# Altium schematic sheet Humidifier.SchDoc
size A3
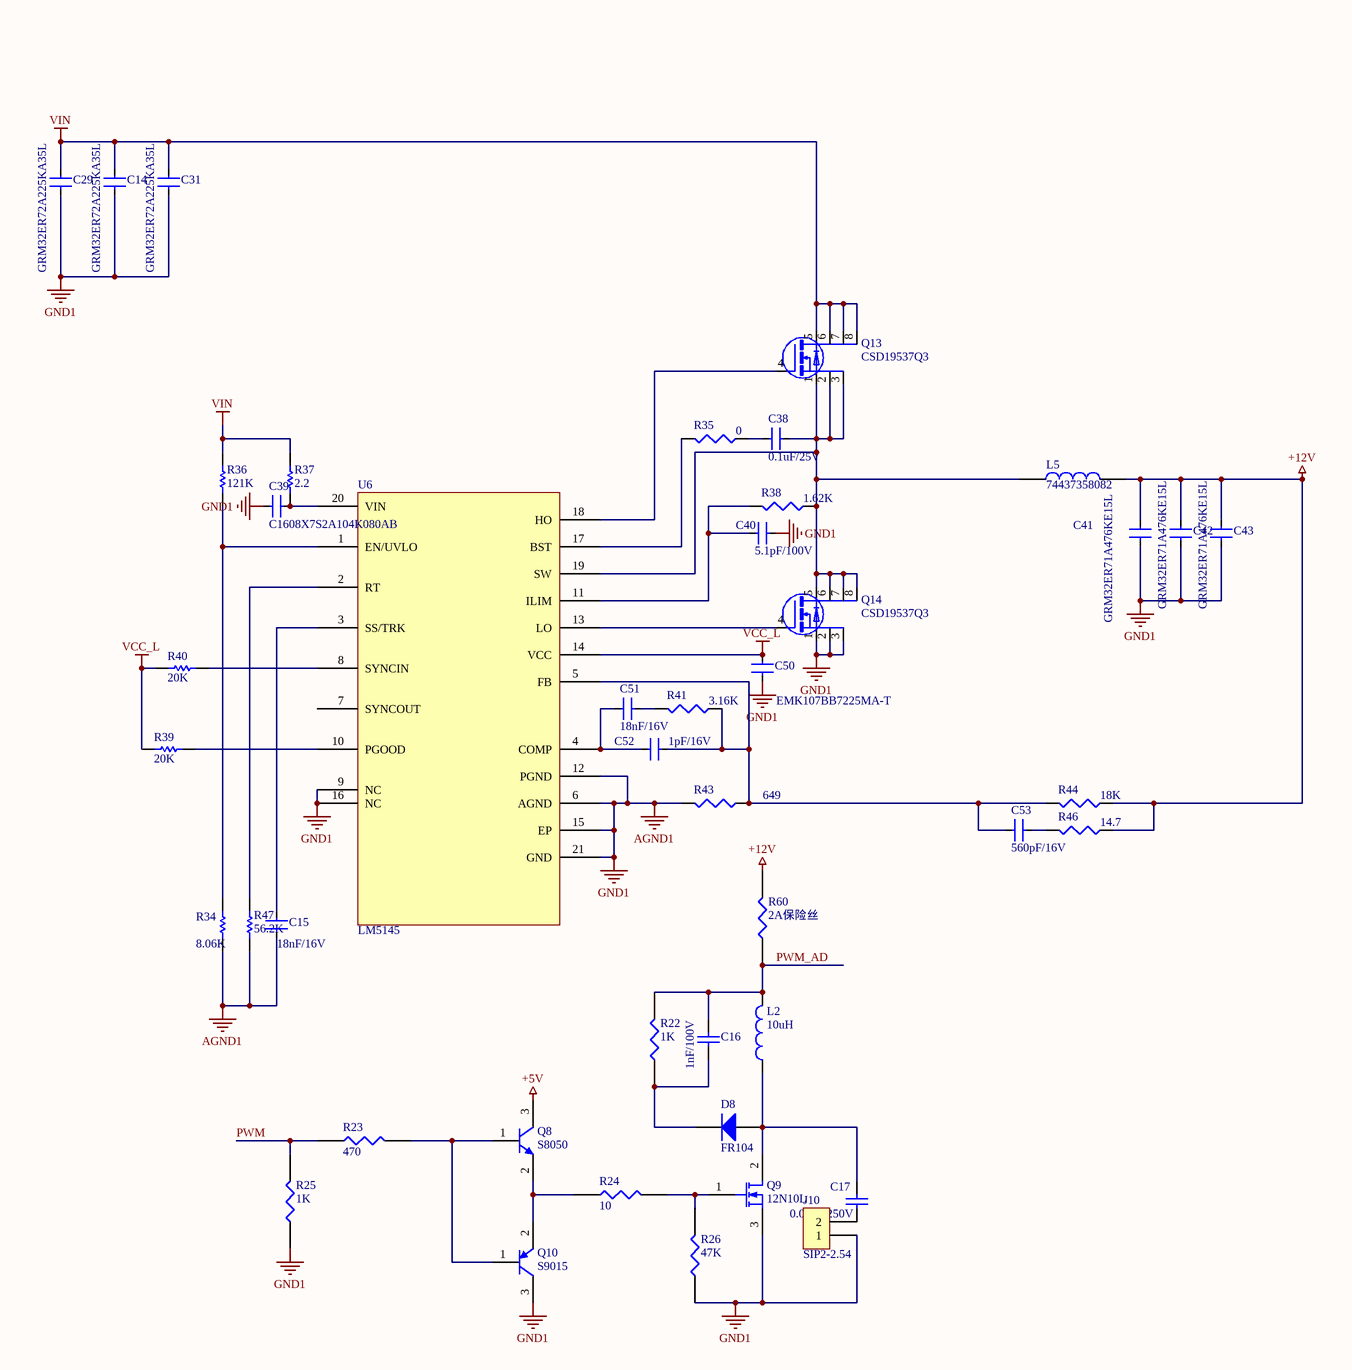
[diagram p0: Humidifier.SchDoc]

## Parts
C14  GRM32ER72A225KA35L  [1210C]
C15  18nF/16V  [0603C]
C16  1nF/100V  [CAP_5MM]
C17  0.047F/250V  [CAP_5MM]
C29  GRM32ER72A225KA35L  [1210C]
C31  GRM32ER72A225KA35L  [1210C]
C38  0.1uF/25V  [0603C]
C39  C1608X7S2A104K080AB  [0603C]
C40  5.1pF/100V  [0603C]
C41  GRM32ER71A476KE15L  [1210C]
C42  GRM32ER71A476KE15L  [1210C]
C43  GRM32ER71A476KE15L  [1210C]
C50  EMK107BB7225MA-T  [0603C]
C51  18nF/16V  [0603C]
C52  1pF/16V  [0603C]
C53  560pF/16V  [0603C]
D8  FR104  [SMA]
J10  SIP2-2.54  [SIP-2L]
L2  10uH  [6*8]
L5  74437358082  [SRP1270-2R2M]
Q8  S8050  [SOT23-3]
Q9  12N10L  [TO230P973X238-3N]
Q10  S9015  [SOT23-3]
Q13  CSD19537Q3  [PowerPAK SO-8]
Q14  CSD19537Q3  [PowerPAK SO-8]
R22  1K  [0805R]
R23  470  [0805R]
R24  10  [0805R]
R25  1K  [0805R]
R26  47K  [0805R]
R34  8.06K  [0603R]
R35  0  [0603R]
R36  121K  [0805R]
R37  2.2  [0603R]
R38  1.62K  [0603R]
R39  20K  [0603R]
R40  20K  [0603R]
R41  3.16K  [0603R]
R43  649  [0603R]
R44  18K  [0603R]
R46  14.7  [0603R]
R47  56.2K  [0603R]
R60  2A保险丝  [0805R]
U6  LM5145  [QFN050P600-8N]

## Nets
+5V: Q8.3(C)
+12V: C41.1 C42.1 C43.1 L5.2 R44.1 R46.1 R60.2
AGND1: C14.2 C15.2 C29.2 C31.2 C39.1 C40.1 C41.2 C42.2 C43.2 C50.2 J10.1 Q9.3(S) Q10.3(C) Q14.1(S) Q14.2(S) Q14.3(S) R25.1 R26.1 R34.1 R43.2 R47.1 U6.6(AGND) U6.9(NC) U6.12(PGND) U6.15(EP) U6.16(NC) U6.21(GND)  [also labelled GND1]
VCC_L: C50.1 R39.2 R40.2 U6.14(VCC)
VIN: C14.1 C29.1 C31.1 Q13.5(D) Q13.6(D) Q13.7(D) Q13.8(D) R36.2 R37.1
PWM: R23.1 R25.2
PWM_AD: C16.2 L2.2 R22.2 R60.1
NetC15_1: C15.1 U6.3(SS/TRK)
NetC16_1: C16.1 D8.2(K) R22.1
NetC17_1: C17.1 J10.2
NetC17_2: C17.2 D8.1(A) L2.1 Q9.2(D)
NetC38_1: C38.1 R35.1
NetC38_2: C38.2 L5.1 Q13.1(S) Q13.2(S) Q13.3(S) Q14.5(D) Q14.6(D) Q14.7(D) Q14.8(D) R38.1 U6.19(SW)
NetC39_2: C39.2 R37.2 U6.20(VIN)
NetC40_2: C40.2 R38.2 U6.11(ILIM)
NetC51_1: C51.1 C52.1 U6.4(COMP)
NetC51_2: C51.2 R41.2
NetC52_2: C52.2 C53.1 R41.1 R43.1 R44.2 U6.5(FB)
NetC53_2: C53.2 R46.2
NetQ8_1: Q8.1(B) Q10.1(B) R23.2
NetQ8_2: Q8.2(E) Q10.2(E) R24.1
NetQ9_1: Q9.1(G) R24.2 R26.2
NetQ13_4: Q13.4(G) U6.18(HO)
NetQ14_4: Q14.4(G) U6.13(LO)
NetR34_2: R34.2 R36.1 U6.1(EN/UVLO)
NetR35_2: R35.2 U6.17(BST)
NetR39_1: R39.1 U6.10(PGOOD)
NetR40_1: R40.1 U6.8(SYNCIN)
NetR47_2: R47.2 U6.2(RT)

Not connected (* = marked no-connect by the designer): U6 7(SYNCOUT)

## Library data of the parts
C14 C15 C29 C31 C38-C43 C50-C53 = 0.01UF: CCX85-103
C16 = Cap: Capacitor; Published: 8-Jun-2000; LatestRevisionDate: 17-Jul-2002; LatestRevisionNote: Re-released for DXP Platform.; PackageReference: RAD-0.3; Publisher: Altium Limited; Value: 1nF/100V
C17 = Cap: Capacitor; Value: 1nF/100V; Published: 8-Jun-2000; LatestRevisionDate: 17-Jul-2002; LatestRevisionNote: Re-released for DXP Platform.; PackageReference: RAD-0.3; Publisher: Altium Limited
D8 = Diode_2: Default Diode; Published: 8-Jun-2000; LatestRevisionDate: 17-Jul-2002; LatestRevisionNote: Re-released for DXP Platform.; PackageVersion: Sep-1996; PackageReference: SMC; Publisher: Altium Limited; PackageDescription: DO-214-AB/SMC; 2 C-Bend Leads; Body 7.9 x 5.9 mm, inc. leads (LxW); Code_JEDEC: DO-214-AB
J10 = SIP2-2.54: CN-SIP2-2.54
L2 = Inductor: Code_IEC: 1005; Published: 8-Jun-2000; LatestRevisionDate: 29-May-2009; LatestRevisionNote: IPC-7351 Footprint Added.; PackageReference: 0402-A; Publisher: Altium Limited; PackageDescription: Chip Inductor; Code_JEITA: 0402; Value: 10uH
L5 = INDUCTOR
Q8 = NPN: NPN Bipolar Transistor; Published: 8-Jun-2000; LatestRevisionDate: 17-Jul-2002; LatestRevisionNote: Re-released for DXP Platform.; PackageReference: TO-226; Publisher: Altium Limited; Code_JEDEC: TO-226-AA
Q9 = MOSFET-N: N-Channel MOSFET; Published: 8-Jun-2000; LatestRevisionDate: 17-Jul-2002; LatestRevisionNote: Re-released for DXP Platform.; PackageVersion: 1995/1996; PackageReference: E3; Publisher: Altium Limited
Q10 = PNP: PNP Bipolar Transistor; Published: 8-Jun-2000; LatestRevisionDate: 29-May-2009; LatestRevisionNote: IPC-7351 Footprint Added.; PackageVersion: Aug-1999; PackageReference: SOT-23B; Publisher: Altium Limited; PackageDescription: 3-Pin SOT-23 Package 0.95 mm Pitch, 2.4 mm Lead Span
Q13 Q14 = Si4004DY
R22-R26 R60 = RES1
R34 R36 R37 R39 R40 R47 = Res Semi: Semiconductor Resistor; Value: 1K; Published: 8-Jun-2000; LatestRevisionDate: 17-Jul-2002; LatestRevisionNote: Re-released for DXP Platform.; PackageReference: AXIAL-0.5; Publisher: Altium Limited
R35 R38 R41 R43 R44 R46 = Res3: Resistor; Published: 8-Jun-2000; LatestRevisionDate: 29-May-2009; LatestRevisionNote: IPC-7351 Footprint Added.; PackageReference: J1-0603; Publisher: Altium Limited; PackageDescription: Chip Resistor